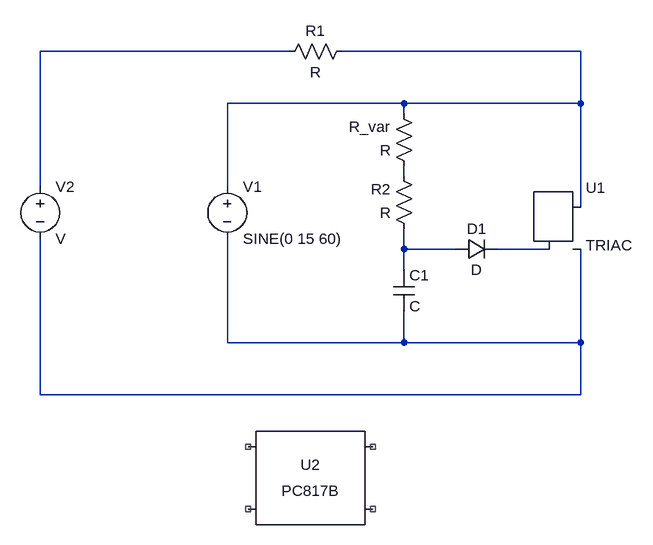
[diagram p0: schematic Draft1.asc]
Draft1.asc, the LTspice schematic file:
Version 4.1
SHEET 1 880 688
WIRE -144 -64 -528 -64
WIRE 304 -64 -64 -64
WIRE 32 16 -240 16
WIRE 304 16 304 -64
WIRE 304 16 32 16
WIRE 32 32 32 16
WIRE 32 128 32 112
WIRE -528 144 -528 -64
WIRE -240 144 -240 16
WIRE 304 176 304 16
WIRE 32 240 32 208
WIRE 112 240 32 240
WIRE 256 240 176 240
WIRE 32 272 32 240
WIRE -240 384 -240 224
WIRE 32 384 32 336
WIRE 32 384 -240 384
WIRE 304 384 304 240
WIRE 304 384 32 384
WIRE -528 464 -528 224
WIRE 304 464 304 384
WIRE 304 464 -528 464
SYMBOL Misc\\TRIAC 272 176 R0
SYMATTR InstName U1
SYMBOL voltage -240 128 R0
WINDOW 123 0 0 Left 0
WINDOW 39 0 0 Left 0
SYMATTR InstName V1
SYMATTR Value SINE(0 15 60)
SYMBOL res 48 224 R180
WINDOW 0 36 76 Left 2
WINDOW 3 36 40 Left 2
SYMATTR InstName R2
SYMBOL res 48 128 R180
WINDOW 0 36 76 Left 2
WINDOW 3 36 40 Left 2
SYMATTR InstName R_var
SYMBOL cap 16 272 R0
SYMATTR InstName C1
SYMBOL diode 112 256 R270
WINDOW 0 32 32 VTop 2
WINDOW 3 0 32 VBottom 2
SYMATTR InstName D1
SYMBOL voltage -528 128 R0
SYMATTR InstName V2
SYMBOL res -48 -80 R90
WINDOW 0 0 56 VBottom 2
WINDOW 3 32 56 VTop 2
SYMATTR InstName R1
SYMBOL Optos\\PC817B -112 592 R0
SYMATTR InstName U2

The netlist it stands for:
* Draft1.asc
X§U1 N002 N005 N006 TRIAC  ; pins MT2 G MT1
V1 N002 N006 SINE(0 15 60)
R2 N004 N003 R
R_var N003 N002 R
C1 N004 N006 C
D1 N004 N005 D
V2 N001 N006 V
R1 N002 N001 R
X§U2 NC_01 NC_02 NC_03 NC_04 PC817 Igain=1.5m
.model D D
.lib standard.dio
.lib PC817.sub
.backanno
.end